# Altium schematic sheet block_v6.SchDoc: mcHF QRP Transceiver
size A4; Author: Krassi A; CompanyName: M0NKA; Revision: 0.6.4; SheetTotal: 1
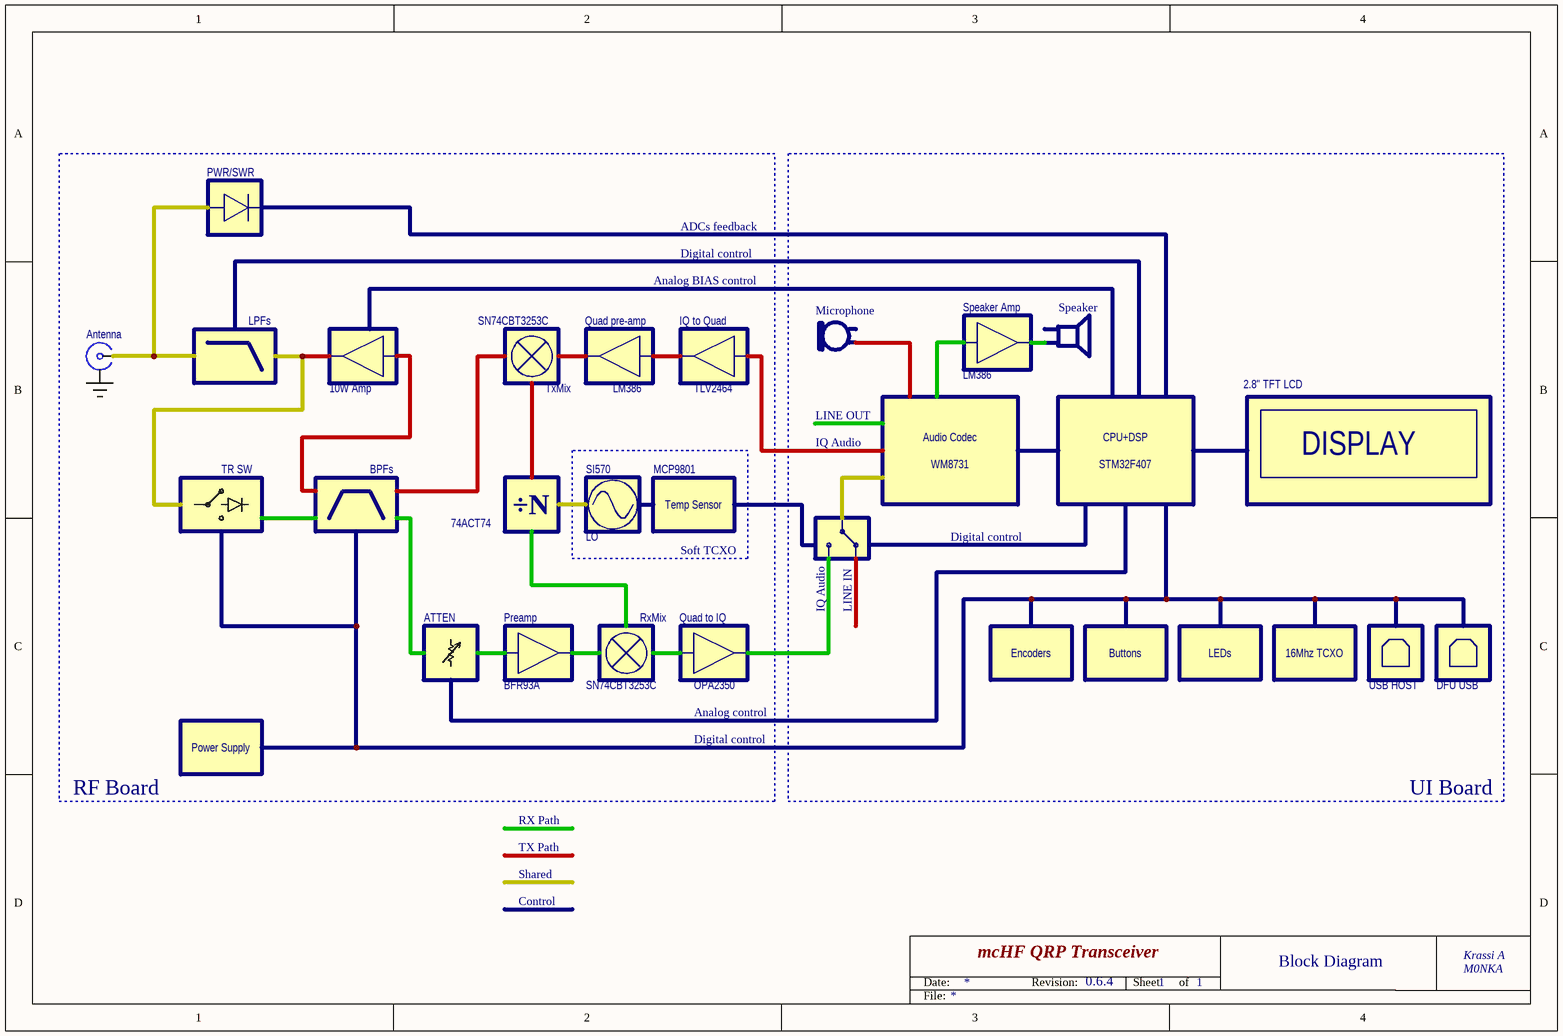
[diagram p0: block_v6.SchDoc]

## Parts
2.8"_TFT_LCD  DISPLAY  (value not drawn)
10W_Amp  AMP  (value not drawn)
16Mhz_TCXO  BLK-SM  (value not drawn)
Antenna  CON-RF  (value not drawn)
Audio_Codec  WM8731
Audio_SW  SW-SPDT  (value not drawn)
BPFs  FILTER-BP  (value not drawn)
Buttons  BLK-SM  (value not drawn)
DFU_USB  CON-USB  (value not drawn)
Encoders  BLK-SM  (value not drawn)
IQ_to_Quad  TLV2464
LEDs  BLK-SM  (value not drawn)
LPFs  FILTER-LP  (value not drawn)
Microphone  Mic2  [PIN2]  (value not drawn)
Preamp  BFR93A
pwr  Power Supply
PWR/SWR  DET-POWER  (value not drawn)
Quad_pre-amp  LM386
Quad_to_IQ  OPA2350
R1  ATTEN
RxMix  SN74CBT3253C
SI570  LO
Speaker  Speaker  [PIN2]  (value not drawn)
Speaker_Amp  LM386
STM32F407  CPU+DSP
Temp_Sensor  MCP9801
TR_SW  TR SW  (value not drawn)
Tx_Quad_Clk  74ACT74
TxMix  SN74CBT3253C
USB_HOST  CON-USB  (value not drawn)

## Blocks framed on the sheet
UI Board: 2.8"_TFT_LCD 16Mhz_TCXO Audio_Codec Audio_SW Buttons DFU_USB Encoders LEDs Microphone Speaker Speaker_Amp STM32F407 USB_HOST
Soft TCXO: SI570 Temp_Sensor

## Notes on the sheet
- ADCs feedback
- Analog BIAS control
- Digital control
- IQ Audio
- LINE OUT
- (near Audio_SW) IQ Audio
- (near Audio_SW) LINE IN
- Analog control
- RF Board
- RX Path
- TX Path
- Control
- Shared
- 1
- Block Diagram
- Date:
- Revision:
- Sheet
- of
- File:
- (in symbol DIVIDER) ÷N

## Library data of the parts
Audio_Codec STM32F407 = BLK-LG
IQ_to_Quad Preamp Quad_pre-amp Quad_to_IQ Speaker_Amp = AMP
Microphone = Mic2: Microphone; Published: 24-Mar-1999; LatestRevisionDate: 17-Jul-2002; LatestRevisionNote: Re-released for DXP Platform.; PackageReference: PIN2; Publisher: Altium Limited
pwr Temp_Sensor = BLK-SM
R1 = ATTEN-VAR
RxMix TxMix = MIXER
SI570 = VCO
Speaker = Speaker: Loudspeaker; Published: 24-Mar-1999; LatestRevisionDate: 17-Jul-2002; LatestRevisionNote: Re-released for DXP Platform.; PackageReference: PIN2; Publisher: Altium Limited
Tx_Quad_Clk = DIVIDER